# EAGLE design WeatherStation_pcb (EAGLE 7.5.0)
COMPANY: Unparallel; DRAWN: KTOWN; REV: B
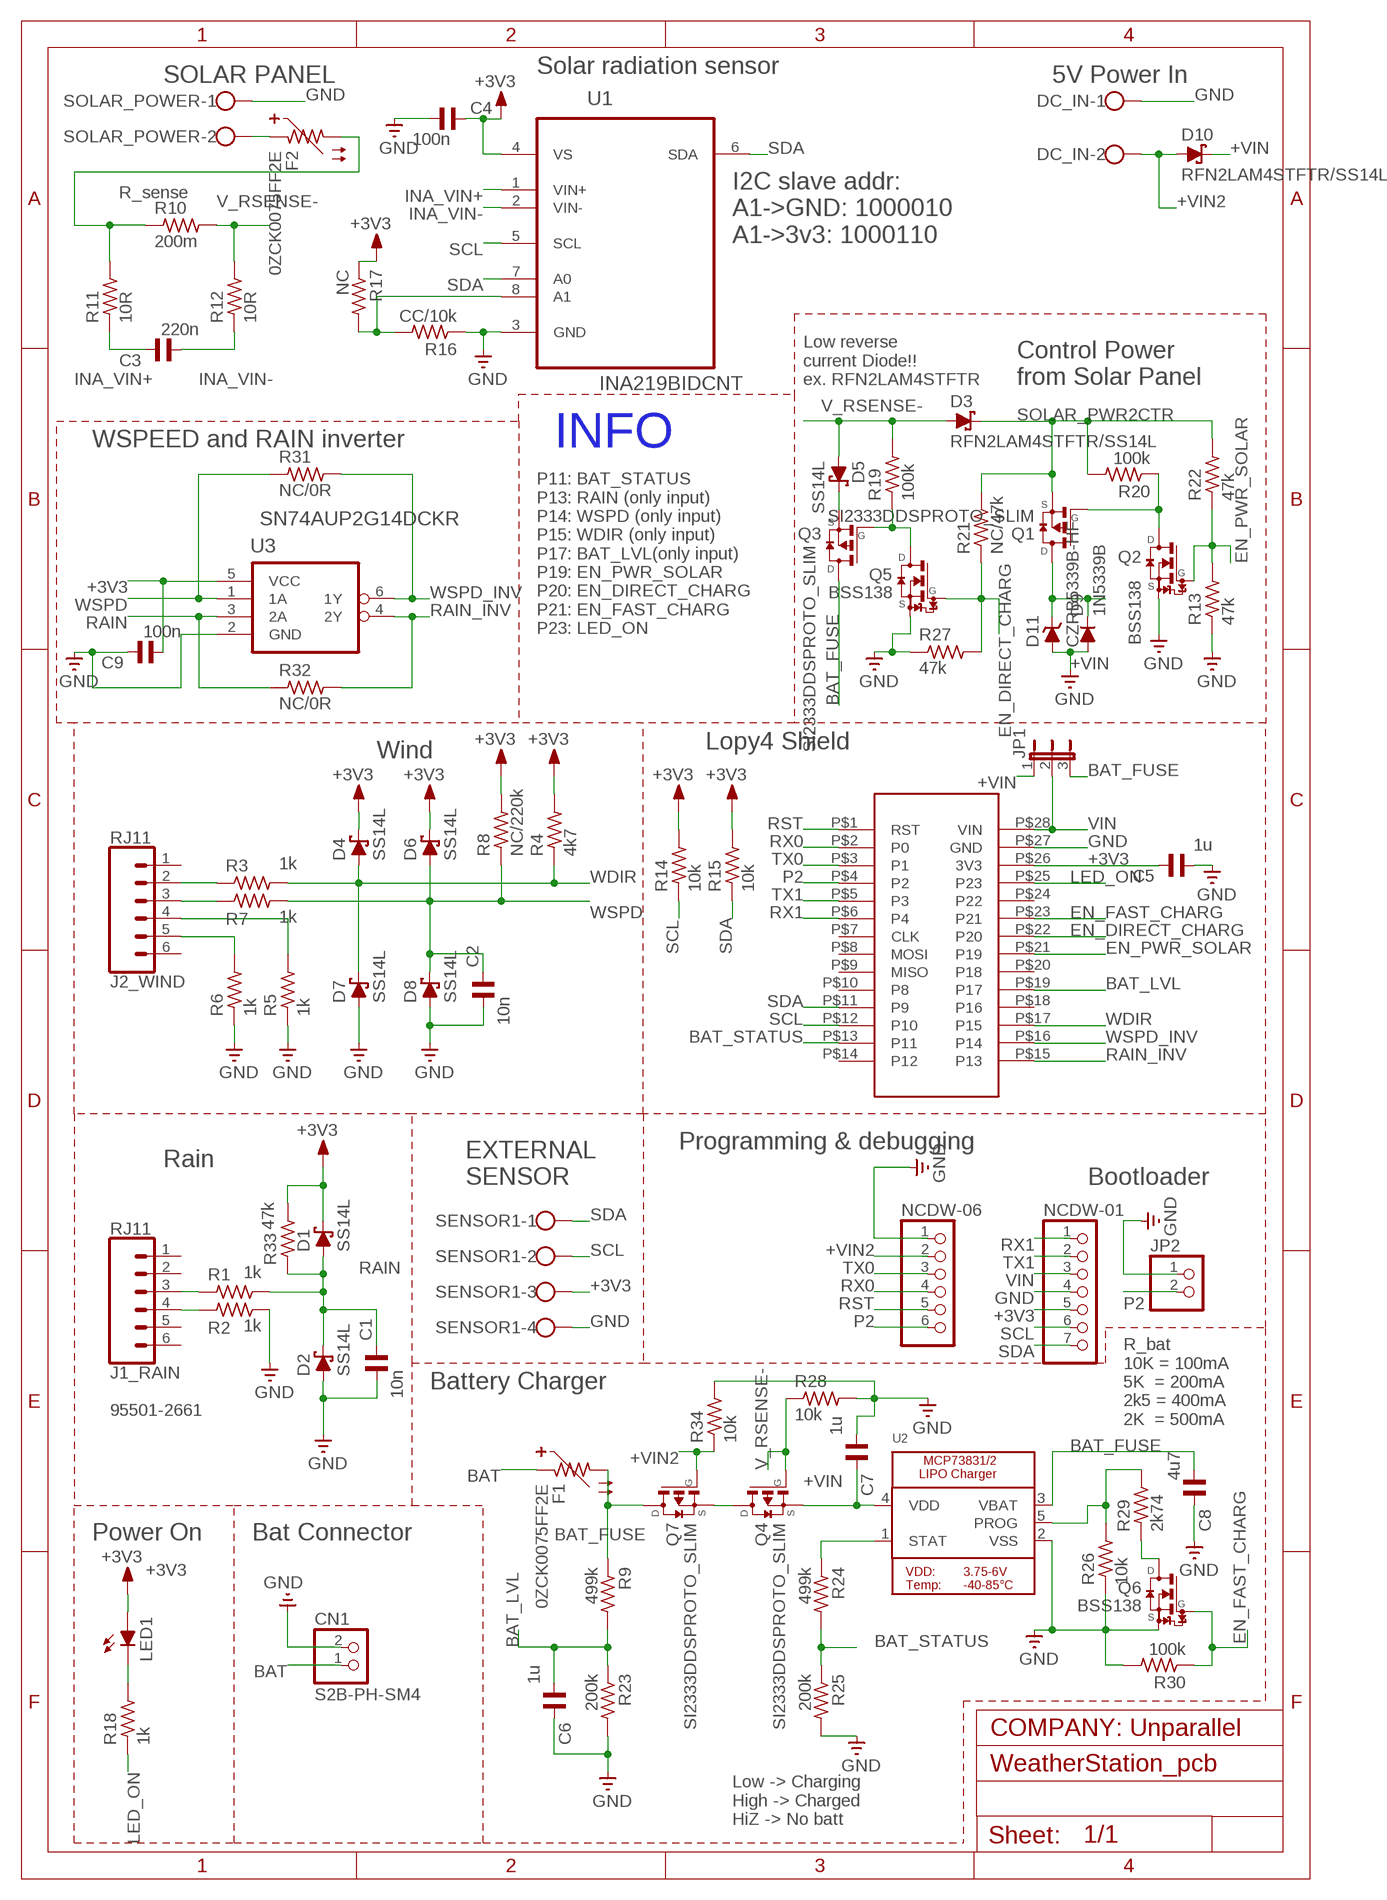
[diagram p0: schematic, sheet 1]

## Parts
C1  10n  C-EUC0603/C0805_PROTO_SLIM  [C0603/C0805_PROTO_SLIM]
C2  10n  C-EUC0603/C0805_PROTO_SLIM  [C0603/C0805_PROTO_SLIM]
C3  220n  C-EUC0603  [C0603]
C4  100n  C-EUC0603  [C0603]
C5  1u  C-EUC0603/C0805_PROTO_SLIM  [C0603/C0805_PROTO_SLIM]
C6  1u  C-EUC0603/C0805_PROTO_SLIM  [C0603/C0805_PROTO_SLIM]
C7  1u  C-EUC0603/C0805_PROTO_SLIM  [C0603/C0805_PROTO_SLIM]
C8  4u7  C-EUC0603/C0805_PROTO_SLIM  [C0603/C0805_PROTO_SLIM]
C9  100n  C-EUC0603  [C0603]
CN1  S2B-PH-SM4  JST_2PIN-SMT-RA  [JST-PH-2-SMT-RA]
D1  SS14L  SCHOTTKY-DIODESUB_SMA_PROTO  [SUB_SMA_PROTO]
D2  SS14L  SCHOTTKY-DIODESUB_SMA_PROTO  [SUB_SMA_PROTO]
D3  RFN2LAM4STFTR/SS14L  SCHOTTKY-DIODESMA_SOD-128_PROTO  [SMA_SOD-128_PROTO]
D4  SS14L  SCHOTTKY-DIODESUB_SMA_PROTO  [SUB_SMA_PROTO]
D5  SS14L  SCHOTTKY-DIODESUB_SMA_PROTO  [SUB_SMA_PROTO]
D6  SS14L  SCHOTTKY-DIODESUB_SMA_PROTO  [SUB_SMA_PROTO]
D7  SS14L  SCHOTTKY-DIODESUB_SMA_PROTO  [SUB_SMA_PROTO]
D8  SS14L  SCHOTTKY-DIODESUB_SMA_PROTO  [SUB_SMA_PROTO]
D9  1N5339B  DIODE-DO15-12  [DO15-12]
D10  RFN2LAM4STFTR/SS14L  SCHOTTKY-DIODESMA_SOD-128_PROTO  [SMA_SOD-128_PROTO]
D11  CZRB5339B-HF  ZENER-DIODE-PROTO  [SMB_PROTO]
DC_IN  W237-102  [W237-102]
F1  0ZCK0075FF2E  PTC-0603_0805_PROTO_SLIM  [R0603/R0805_PROTO_SLIM]
F2  0ZCK0075FF2E  PTC-0805  [R0805]
J1_RAIN  RJ11  RJ11-6  [RJ11-6]
J2_WIND  RJ11  RJ11-6  [RJ11-6]
JP1  JP2E-0805  [R0805/2]
JP2  PINHD-1X2  [1X02]
LED1  LEDCHIP-LED0805  [CHIP-LED0805]
NCDW-01  PINHD-1X7  [1X07]
NCDW-06  PINHD-1X6  [1X06]
Q1  SI2333DDSPROTO_SLIM  [SOT23_PROTO_SLIM]
Q2  BSS138  NX7002AKPROTO_SLIM  [SOT23_PROTO_SLIM]
Q3  SI2333DDSPROTO_SLIM  [SOT23_PROTO_SLIM]
Q4  SI2333DDSPROTO_SLIM  [SOT23_PROTO_SLIM]
Q5  BSS138  NX7002AKPROTO_SLIM  [SOT23_PROTO_SLIM]
Q6  BSS138  NX7002AKPROTO_SLIM  [SOT23_PROTO_SLIM]
Q7  SI2333DDSPROTO_SLIM  [SOT23_PROTO_SLIM]
R1  1k  R-EU_R0603  [R0603]
R2  1k  R-EU_R0603  [R0603]
R3  1k  R-EU_R0603  [R0603]
R4  4k7  R-EU_R0603/R0805_PROTO_SLIM  [R0603/R0805_PROTO_SLIM]
R5  1k  R-EU_R0603  [R0603]
R6  1k  R-EU_R0603  [R0603]
R7  1k  R-EU_R0603  [R0603]
R8  NC/220k  R-EU_R0603/R0805_PROTO_SLIM  [R0603/R0805_PROTO_SLIM]
R9  499k  R-EU_R0603/R0805_PROTO_SLIM  [R0603/R0805_PROTO_SLIM]
R10  200m  R-EU_R0603/R0805_PROTO_SLIM  [R0603/R0805_PROTO_SLIM]
R11  10R  R-EU_R0603  [R0603]
R12  10R  R-EU_R0603  [R0603]
R13  47k  R-EU_R0603  [R0603]
R14  10k  R-EU_R0603  [R0603]
R15  10k  R-EU_R0603  [R0603]
R16  CC/10k  R-EU_R0603  [R0603]
R17  NC  R-EU_R0603  [R0603]
R18  1k  R-EU_R0603  [R0603]
R19  100k  R-EU_R0603  [R0603]
R20  100k  R-EU_R0603  [R0603]
R21  NC/47k  R-EU_R0603  [R0603]
R22  47k  R-EU_R0603  [R0603]
R23  200k  R-EU_R0603/R0805_PROTO_SLIM  [R0603/R0805_PROTO_SLIM]
R24  499k  R-EU_R0603/R0805_PROTO_SLIM  [R0603/R0805_PROTO_SLIM]
R25  200k  R-EU_R0603/R0805_PROTO_SLIM  [R0603/R0805_PROTO_SLIM]
R26  10k  R-EU_R0603/R0805_PROTO_SLIM  [R0603/R0805_PROTO_SLIM]
R27  47k  R-EU_R0603  [R0603]
R28  10k  R-EU_R0603  [R0603]
R29  2k74  R-EU_R0603/R0805_PROTO_SLIM  [R0603/R0805_PROTO_SLIM]
R30  100k  R-EU_R0603/R0805_PROTO_SLIM  [R0603/R0805_PROTO_SLIM]
R31  NC/0R  R-EU_R0603/R0805_PROTO_SLIM  [R0603/R0805_PROTO_SLIM]
R32  NC/0R  R-EU_R0603/R0805_PROTO_SLIM  [R0603/R0805_PROTO_SLIM]
R33  47k  R-EU_R0603  [R0603]
R34  10k  R-EU_R0603  [R0603]
SENSOR1  W237-4  [W237-4]
SOLAR_POWER  W237-102  [W237-102]
U1  INA219BIDCNT  [SOT65P280X145-8N]
U2  MCP73831/2  [SOT23-5]
U3  SN74AUP2G14DCKR  SN74AUP2G14-DCKR  [SOT65P210X110-6N_EDIT]
U$2  LOPY4_SHIELD  [LOPY4_SHIELD]

## Nets
+3V3: C4.1 C5.1 C9.2 D1.C D4.C D6.C LED1.A NCDW-01.5 R4.2 R8.2 R14.2 R15.2 R17.1 R33.2 SENSOR1.3 U1.4(VS) U3.5(VCC) U$2.P$26(3V3)
+VIN: C7.1 D9.C D10.C D11.C JP1.1 Q1.3(D) Q4.2(S) U2.4(VDD)
+VIN2: D10.A DC_IN.2 NCDW-06.2 Q7.1(G) R34.1
BAT: CN1.1 F1.1
BAT_FUSE: C8.2 F1.2 JP1.3 Q3.3(D) Q7.3(D) R9.1 U2.3(VBAT)
BAT_LVL: C6.2 R9.2 R23.1 U$2.P$19(P17)
BAT_STATUS: R24.2 R25.1 U$2.P$13(P11)
EN_DIRECT_CHARG: Q5.1(G) R21.1 R27.2 U$2.P$22(P20)
EN_FAST_CHARG: Q6.1(G) R30.1 U$2.P$23(P21)
EN_PWR_SOLAR: Q2.1(G) R13.2 R22.1 U$2.P$21(P19)
GND: C1.2 C2.2 C4.2 C5.2 C6.1 C7.2 C8.1 C9.1 CN1.2 D2.A D7.A D8.A D9.A D11.A DC_IN.1 JP2.1 NCDW-01.4 NCDW-06.1 Q2.2(S) Q5.2(S) Q6.2(S) R2.2 R5.1 R6.1 R13.1 R16.1 R23.2 R25.2 R26.1 R27.1 R28.2 R30.2 R34.2 SENSOR1.4 SOLAR_POWER.1 U1.3(GND) U2.2(VSS) U3.2(GND) U$2.P$27(GND)
INA_VIN+: C3.1 R11.1 U1.1(VIN+)
INA_VIN-: C3.2 R12.1 U1.2(VIN-)
LED_ON: R18.1 U$2.P$25(P23)
N$1: D5.C Q3.2(S)
N$2: F2.1 SOLAR_POWER.2
N$3: J1_RAIN.4 R2.1
N$4: J1_RAIN.3 R1.1
N$5: J2_WIND.2 R3.1
N$6: J2_WIND.3 R7.1
N$7: J2_WIND.4 R5.2
N$8: J2_WIND.5 R6.2
N$10: R26.2 R29.2 U2.5(PROG)
N$11: R16.2 R17.2 U1.8(A1)
N$12: LED1.C R18.2
N$13: Q6.3(D) R29.1
N$15: Q3.1(G) Q5.3(D) R19.1
N$18: Q1.1(G) Q2.3(D) R20.1
N$19: R24.1 U2.1(STAT)
N$21: Q4.3(D) Q7.2(S)
P2: JP2.2 NCDW-06.6 U$2.P$4(P2)
RAIN: C1.1 D1.A D2.C R1.2 R32.1 R33.1 U3.3(2A)
RAIN_INV: R32.2 U3.4(2Y) U$2.P$15(P13)
RST: NCDW-06.5 U$2.P$1(RST)
RX0: NCDW-06.4 U$2.P$2(P0)
RX1: NCDW-01.1 U$2.P$6(P4)
SCL: NCDW-01.6 R14.1 SENSOR1.2 U1.5(SCL) U$2.P$12(P10)
SDA: NCDW-01.7 R15.1 SENSOR1.1 U1.6(SDA) U1.7(A0) U$2.P$11(P9)
SOLAR_PWR2CTR: D3.C Q1.2(S) R20.2 R21.2 R22.2
TX0: NCDW-06.3 U$2.P$3(P1)
TX1: NCDW-01.2 U$2.P$5(P3)
V_RSENSE-: D3.A D5.A Q4.1(G) R10.2 R12.2 R19.2 R28.1
VBUS_SOLAR: F2.2 R10.1 R11.2
VIN: JP1.2 NCDW-01.3 U$2.P$28(VIN)
WDIR: D4.A D7.C R3.2 R4.1 U$2.P$17(P15)
WSPD: C2.1 D6.A D8.C R7.2 R8.1 R31.1 U3.1(1A)
WSPD_INV: R31.2 U3.6(1Y) U$2.P$16(P14)
Unconnected: J1_RAIN.1 J1_RAIN.2 J1_RAIN.5 J1_RAIN.6 J2_WIND.1 J2_WIND.6 U$2.P$7(CLK) U$2.P$8(MOSI) U$2.P$9(MISO) U$2.P$10(P8) U$2.P$14(P12) U$2.P$18(P16) U$2.P$20(P18) U$2.P$24(P22)

## Notes on the sheet
- Solar radiation sensor
- SOLAR PANEL | 5V Power In
- R_sense
- I2C slave addr:
  A1->GND: 1000010
  A1->3v3: 1000110
- Low reverse
  current Diode!!
  ex. RFN2LAM4STFTR
- Control Power
  from Solar Panel
- WSPEED and RAIN inverter | INFO
- P11: BAT_STATUS
  P13: RAIN (only input)
  P14: WSPD (only input)
  P15: WDIR (only input)
  P17: BAT_LVL(only input)
  P19: EN_PWR_SOLAR
  P20: EN_DIRECT_CHARG
  P21: EN_FAST_CHARG
  P23: LED_ON
- Lopy4 Shield
- Wind
- Programming & debugging
- Rain
- EXTERNAL
  SENSOR
- Bootloader
- Battery Charger
- 95501-2661
- R_bat
  10K = 100mA
  5K  = 200mA
  2k5 = 400mA
  2K  = 500mA
- Power On | Bat Connector
- Low -> Charging
  High -> Charged
  HiZ -> No batt

## Library data of the parts
C1-C9 = rcl_imp:C-EU: CAPACITOR, European symbol
CN1 = adafruit_edit:JST_2PIN: JST 2-Pin Connectors of various flavors SMT-RA (S2B-PH-SM4) 4UConnector #17311 SMT (B2B-PH-SM4) THM-RA (S2B-PH) THM (B2B-PH)
D1-D8 D10 = diode:SCHOTTKY-DIODE: Schottky Diode
D9 = diode:DIODE-: DIODE
D11 = diode:ZENER-DIODE: Z-Diode
DC_IN SOLAR_POWER = con-wago-500:W237-102: WAGO SCREW CLAMP
F1 F2 = ptc-ntc:PTC: PTC THERMISTOR
J1_RAIN J2_WIND = SparkFun-Connectors:RJ11-6: RJ11 Jack - 6 pin Commonly found on CAT3 devices and some Microchip programmers. Here is the connector we sell at SparkFun: RJ11 6-Pin Connector <https://www.sparkfun.com/products/132> (PRT-00132) Datasheet <http://www.sparkfun.com/datasheets/Prototyping/Connectors/RJ11-Datasheet.pdf> It is used on this SparkFun product: SparkFun Weather Shield <https://www.sparkfun.com/products/12081> (DEV-12081) Weather Meters <https://www.sparkfun.com/products/8942> (SEN-08942); PROD_ID: CONN-08590; SF_ID: PRT-00132
JP1 = jumper:JP2E: JUMPER
JP2 = pinhead:PINHD-1X2: PIN HEADER
LED1 = led:LED: LED Various Types
NCDW-01 = pinhead:PINHD-1X7: PIN HEADER
NCDW-06 = pinhead:PINHD-1X6: PIN HEADER
Q1 Q3 Q4 Q7 = transistor-fet:SI2333DDS: P-Channel MOSFET
Q2 Q5 Q6 = transistor-fet:NX7002AK: N-Channel MOSFET
R1-R34 = rcl_imp:R-EU_: RESISTOR, European symbol
SENSOR1 = con-wago-500:W237-4: WAGO SCREW CLAMP
U1 = Texas Instruments_By_element14_Batch_1_new:INA219BIDCNT: CURRENT/POWER MONITOR with I2C? Interface; MPN: INA219BIDCNT; OC_FARNELL: 1855125; OC_NEWARK: 12T2860; PACKAGE: SOT-23-8; SUPPLIER: TEXAS INSTRUMENTS
U2 = microbuilder:MCP73831/2: MCP73831/2 LIPO Charger VDD: 3.75 - 6V Temp -40 - 85°C Programmable Charge Rate: 15-500mA NOTE: STAT is a tri-state logic output on the MCP73831 and an open-drain output on the MCP73832. SOT23-5 with 4.2V output and tri-state logic on STAT = MCP73831T-2ACI/OT
U3 = PatternAgents-TI:SN74AUP2G14: DUAL INVERTER GATE
U$2 = pycom_lib_edit:LOPY4_SHIELD

## Net classes
0 default: width 0.25 mm, drill 0.3 mm
2 VDD_3.3V: width 0.35 mm, drill 0.3 mm, clearance 0.2 mm

## Board
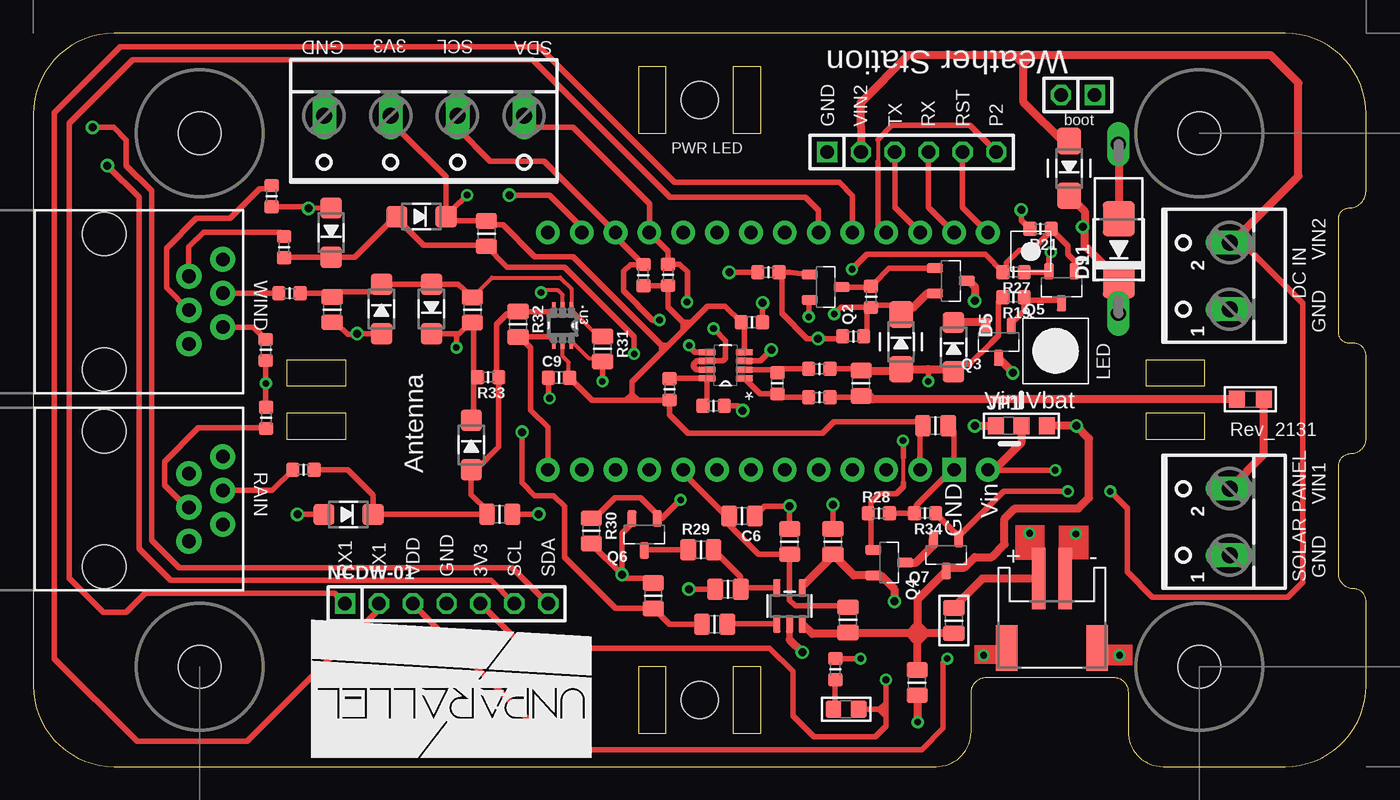
[diagram p1: board, top side]
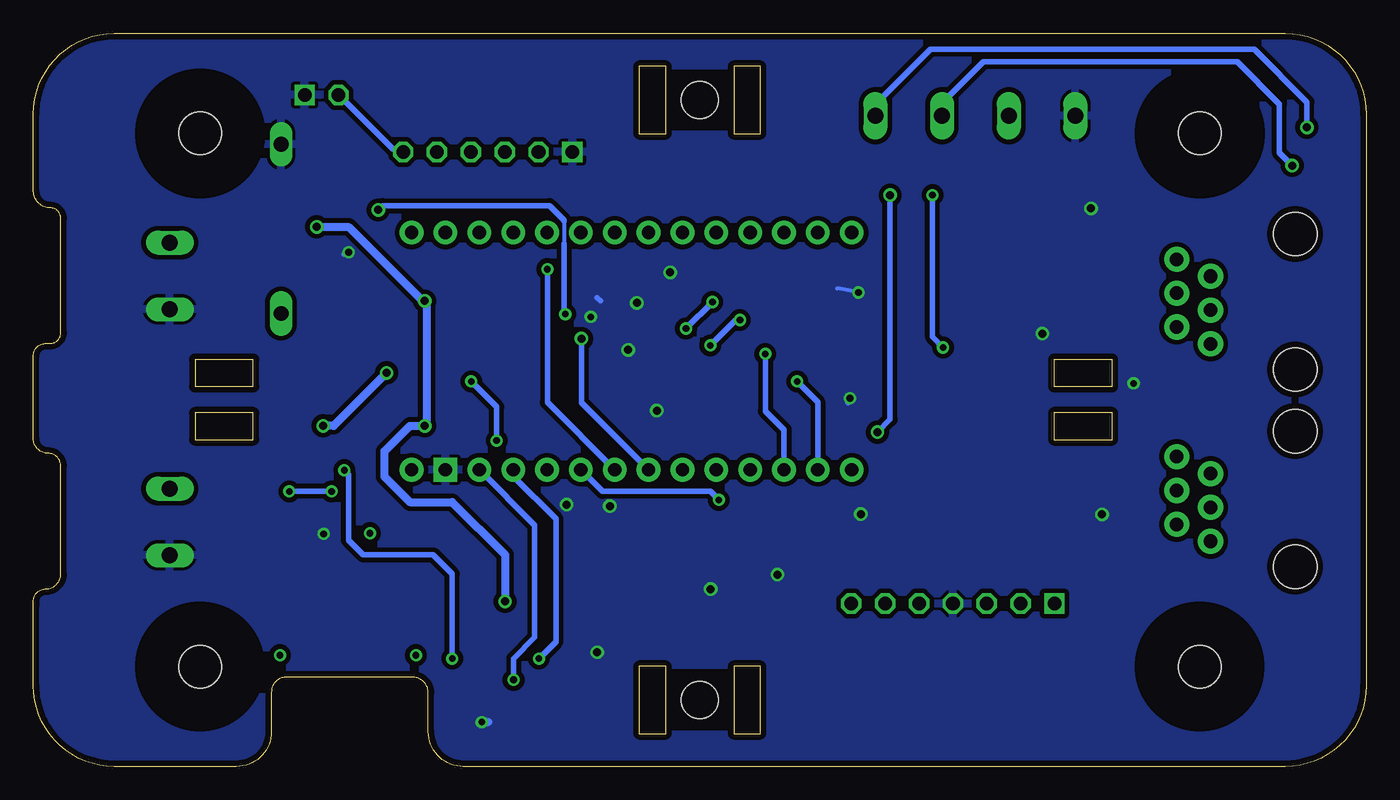
[diagram p2: board, bottom side, seen from below]

Size 100.01 x 55 mm. Coordinates in mm from the lower left corner, seen from the top.
Outline: 6.08,0 67.75,0 arc90 70.38,2.62 70.38,5.51 arc-90 71.52,6.7 81.07,6.7 arc-90 82.15,5.59 82.15,2.62 arc90 84.78,0 93.93,0 arc90 100,6.08 100.01,12.06 100.01,12.38 arc90 99.06,13.34 arc-90 97.95,14.45 97.95,22.54 arc-90 98.9,23.5 arc90 100.01,24.61 100.01,30.8 arc90 99.06,31.75 98.74,31.75 arc-90 97.95,32.54 97.95,41.12 arc-90 98.74,41.91 arc90 100,43.17 100,48.94 arc90 93.93,55 6.08,55 arc90 0,48.92 0,6.08 arc90 6.08,0
Outline: 19.05,26.52 23.43,26.52 23.43,24.52 19.05,24.52 19.05,26.52
Outline: 19.05,30.52 23.43,30.52 23.43,28.52 19.05,28.52 19.05,30.52
Outline: 83.5,26.52 87.88,26.52 87.88,24.52 83.5,24.52 83.5,26.52
Outline: 83.5,30.52 87.88,30.52 87.88,28.52 83.5,28.52 83.5,30.52
Outline: 52.55,47.48 52.55,52.52 54.55,52.52 54.55,47.48 52.55,47.48
Outline: 45.45,47.48 45.45,52.52 47.45,52.52 47.45,47.48 45.45,47.48
Outline: 52.55,2.48 52.55,7.53 54.55,7.53 54.55,2.48 52.55,2.48
Outline: 45.45,2.48 45.45,7.53 47.45,7.53 47.45,2.48 45.45,2.48
Copper layers (1*16): Top 0.035mm / dielectric 1.5mm / Bottom 0.035mm
Design rules "Weather_rules": minimum track width 0.3mm, minimum drill 0.299mm, track to track 14mil, track to pad 14mil, pad to pad 14mil, via to via 12mil, smd to smd 6mil, copper to edge 18mil, drill to drill 12mil, minimum pad ring 10mil, minimum via ring 8mil, stop-mask expansion 2mil, vias tented up to drill 25mil, thermal gap 10mil
Holes 3.2 mm at 12.5,7.5 87.5,7.5 12.5,47.5 87.5,47.5
bRestrict: area 7.8,2.8 to 17.2,12.2; area 7.8,42.8 to 17.1,52.1; area 82.8,42.8 to 92.2,52.2; area 82.8,2.8 to 92.2,12.2

### Footprints (pad centres in the part's own frame; a part is rotated, then mirrored left to right if it is on the bottom)
C0603/C0805_PROTO_SLIM = smd 1.2 x 1.6: 1 -0.95,0; 2 0.95,0
C0603 = smd 1 x 1.1: 1 -0.794,0; 2 0.794,0
JST-PH-2-SMT-RA = smd 1 x 4.6: 1 1,-3.7; 2 -1,-3.7 | smd 1.6 x 3.4: NC1 -3.4,1.5; NC2 3.4,1.5
SUB_SMA_PROTO = smd 1.6 x 1.6: A 1.85,0; C -1.85,0
SMA_SOD-128_PROTO = smd 2 x 1.8: A 2.05,0; C -2.05,0
DO15-12 = drill 1.118 long: A 6.35,0; C -6.35,0
SMB_PROTO = smd 2.6 x 2.4: A 2.322,0; C -2.322,0
W237-102 = drill 1.194 long: 1 -2.5,-1.27; 2 2.5,-1.27
R0603/R0805_PROTO_SLIM = smd 1.2 x 1.6: 1 -0.95,0; 2 0.95,0
R0805 = smd 1.2 x 1.3: 1 -1.016,0; 2 1.016,0
RJ11-6 = drill 1.016 pad 1.88: 1 -3.175,8.89; 2 -1.905,6.35; 3 -0.635,8.89; 4 0.635,6.35; 5 1.905,8.89; 6 3.175,6.35 | hole 3.251: -5.08,0; 5.08,0
R0805/2 = smd 1.2 x 1.3: 1 -1.905,0; 2 0,0; 3 1.905,0
1X02 = drill 1.016 square: 1 -1.27,0 | drill 1.016 octagon: 2 1.27,0
CHIP-LED0805 = smd 1.3 x 1.2: A 0,-0.953; C 0,0.953
1X07 = drill 1.016 square: 1 -7.62,0 | drill 1.016 octagon: 2 -5.08,0; 3 -2.54,0; 4 0,0; 5 2.54,0; 6 5.08,0; 7 7.62,0
1X06 = drill 1.016 square: 1 -6.35,0 | drill 1.016 octagon: 2 -3.81,0; 3 -1.27,0; 4 1.27,0; 5 3.81,0; 6 6.35,0
SOT23_PROTO_SLIM = smd 0.7 x 1.2: 1 -0.95,-1.2; 2 0.95,-1.2; 3 0,1.2
R0603 = smd 1 x 1.1: 1 -0.794,0; 2 0.794,0
W237-4 = drill 1.194 long: 1 -7.5,-1.27; 2 -2.5,-1.27; 3 2.5,-1.27; 4 7.5,-1.27
MOUNTHOLE_110MIL = hole 2.794: 0,0
SOT65P280X145-8N = smd 1.3 x 0.44: 1 -1.4,0.975; 2 -1.4,0.325; 3 -1.4,-0.325; 4 -1.4,-0.975; 5 1.4,-0.975; 6 1.4,-0.325; 7 1.4,0.325; 8 1.4,0.975
SOT23-5 = smd 0.55 x 1.3: 1 -0.95,-1.35; 2 0,-1.35; 3 0.95,-1.35; 4 0.95,1.35; 5 -0.95,1.35
SOT65P210X110-6N_EDIT = smd 1.168 x 0.356: 1 -1.168,0.66; 2 -1.168,0; 3 -1.168,-0.66; 4 1.168,-0.66; 5 1.168,0; 6 1.168,0.66
LOPY4_SHIELD = drill 1 pad 1.778: P$1 0,0; P$2 2.54,0; P$3 5.08,0; P$4 7.62,0; P$5 10.16,0; P$6 12.7,0; P$7 15.24,0; P$8 17.78,0; P$9 20.32,0; P$10 22.86,0; P$11 25.4,0; P$12 27.94,0; P$13 30.48,0; P$14 33.02,0; P$15 33.02,17.78; P$16 30.48,17.78; P$17 27.94,17.78; P$18 25.4,17.78; P$19 22.86,17.78; P$20 20.32,17.78; P$21 17.78,17.78; P$22 15.24,17.78; P$23 12.7,17.78; P$24 10.16,17.78; P$25 7.62,17.78; P$26 5.08,17.78; P$28 0,17.78 | drill 1 pad 1.778 square: P$27 2.54,17.78

### Placement (x,y rotation side)
C1  35,18.93 0 top
C2  22.43,34.27 270 top
C3  55.82,28.75 90 top
C4  53.92,33.33 0 top
C5  67.7,25.57 0 top
C6  53.17,18.79 180 top
C7  60,16.88 90 top
C8  66.32,6.3 90 top
C9  39.44,29.17 0 top
CN1  76.42,10.4 180 top
D1  32.86,24.12 270 top
D2  23.65,18.91 180 top
D3  65.11,31.86 270 top
D4  29.12,41.25 180 top
D5  69.05,31.46 270 top
D6  29.88,34.33 90 top
D7  22.35,40.05 90 top
D8  26.12,34.33 270 top
D9  81.42,40.33 90 top
D10  77.71,44.87 90 top
D11  81.44,38.76 90 top
DC_IN  88.5,36.8 90 top
F1  69.08,10.95 270 top
F2  91.33,27.55 180 top
J1_RAIN  5.33,20.07 270 top
J2_WIND  5.33,34.88 270 top
JP1  74.14,25.56 0 top
JP2  78.38,50.38 180 top
LED1  60.99,4.3 90 top
NCDW-01  31.01,12.22 0 top
NCDW-06  65.91,46.1 0 top
Q1  68.85,36.44 270 top
Q2  59.45,35.96 270 top
Q3  72.43,31.86 180 top
Q4  64.22,15.3 270 top
Q5  77.15,35.96 180 top
Q6  45.86,17.41 180 top
Q7  68.5,15.88 180 top
R1  20.27,22.27 0 top
R2  17.47,26.16 90 top
R3  18.81,38.96 270 top
R4  34,39.98 90 top
R5  17.87,42.79 90 top
R6  17.45,31.25 90 top
R7  19.23,35.5 0 top
R8  32.95,34.25 270 top
R9  61.12,11 90 top
R10  62.11,28.75 90 top
R11  58.98,27.7 0 top
R12  58.98,29.82 0 top
R13  55.16,37.08 0 top
R14  45.77,36.86 270 top
R15  47.63,36.89 270 top
R16  51.05,27.05 180 top
R17  47.75,28.3 90 top
R18  60.18,7.31 270 top
R19  73.55,35.21 180 top
R20  62.87,35.23 270 top
R21  75.57,40.34 180 top
R22  61.52,32.27 0 top
R23  56.75,16.88 90 top
R24  51.12,10.68 180 top
R25  46.52,12.82 90 top
R26  52.12,13.3 0 top
R27  73.55,37.08 180 top
R28  63.45,19 0 top
R29  50.09,16.27 0 top
R30  41.87,17.67 270 top
R31  42.72,31.32 270 top
R32  36.37,33.17 270 top
R33  34.13,29.21 180 top
R34  66.91,19 180 top
SENSOR1  29.32,47.55 180 top
SOLAR_POWER  88.5,18.35 90 top
STAND2  [MOUNTHOLE_110MIL]  50,5 90 top
STAND3  [MOUNTHOLE_110MIL]  50,50 90 top
U1  51.95,30.1 180 top
U2  56.75,12.05 0 top
U3  39.71,33.09 270 top
U$1  [UNPARALLEL_LOGO_NEW_0_INVERT_BIG]  41.91,11.01 180 top
U$2  71.62,40.05 180 top

### Tracks (layer width: path | path; a pad name or v marks a point on that pad's centre or on a via)
+3V3  (via drill 0.5)
  Top 0.305: C9.2 40.16,29.24 40.16,30.32 39.71,30.77 U3.5
  Top 0.406: U1.4 53.35,33.11 C4.1 51.92,34.54 50.59,34.54 48.75,32.69 | 31.75,32.48 31.95,32.48 32.67,33.2 R8.2 33.19,33.19 32.89,33.02 33.02,33.02 33.02,28.73 | 31.75,32.48 D6.C | 32.89,26 D1.C 33.02,26.13 33.02,28.73 | SENSOR1.3 26.8,48.42 27.43,47.77 30.98,44.23 30.98,41.75 | 30.98,41.75 D4.C 31.27,40.96 31.3,40.93 R4.2 34.34,40.64 35.24,40.64 37.62,38.26 40.48,38.26 47.15,31.59 | 48.75,32.69 47,30.95 | 47,30.95 44.93,28.87 44.93,27.94 | C9.2 41.94,27.46 45.4,27.46 | 45.4,27.46 47.71,27.46 R17.1 47.75,26.38 49.12,25 59.21,25 60.09,25.88 66.36,25.88 66.66,25.57 C5.1 66.55,25.36 U$2.P$26 | 44.45,27.46 44.93,27.94 | 44.93,27.94 45.4,27.46 | R14.2 47.29,36.07 R15.2 47.63,34.44 48.74,33.34 | 49.37,33.34 48.74,33.34 | 48.74,33.34 48.74,32.7 48.75,32.69 | R33.2 33.5,29.21 | 33.02,29.53 33.5,29.21 | 33.5,29.21 33.02,28.73 | 47.31,31.43 47.15,31.59 | 47.15,31.59 47.62,31.59 | 47.15,31.59 47.15,31.11 47,30.95 | v31.75,31.43 31.75,32.48 | v32.54,42.86 31.43,41.75 30.98,41.75 | 63.98,5.86 v63.98,6.51 63.98,4.76 | NCDW-01.5 36.88,8.89 55.24,8.89 56.99,7.14 56.99,3.81 58.58,2.22 63.18,2.22 63.98,3.02 63.98,4.76 | LED1.A 62.23,4.3 62.23,4.29 63.5,4.29 | 63.98,3.81 63.5,4.29 | 63.5,4.29 63.98,4.76
  Bottom 0.406: 26.82,47.35 SENSOR1.3 | v31.75,31.43 32.54,32.23 v32.54,42.86 | U$2.P$26 62.39,18.11 62.39,9.68 63.98,8.1 v63.98,6.51 63.82,6.67
+VIN  (via drill 0.6)
  Top 0.5: 57.78,13.61 57.7,13.53 U2.4
  Top 0.61: Q1.3 70.17,36.43 70.22,36.43 70.64,36.01 v70.64,34.92 | v70.64,25.56 JP1.1 | v64.61,12.38 64.61,13.34 63.6,14.35 Q4.2 61.58,14.35 C7.1 60,15.82 57.78,13.61 | D9.C 81.44,34 D11.C 81.44,36.51 78.9,39.05 78.9,40.32 | D10.C 78.9,41.64 78.9,40.32 | 78.9,40.32 v78.74,40.48
  Bottom 0.61: v64.61,12.38 64.61,15.88 68.58,19.84 71.75,19.84 73.66,21.75 73.66,23.65 71.75,25.56 v70.64,25.56 70.48,25.72 70.48,34.77 v70.64,34.92 70.8,34.92 76.36,40.48 v78.74,40.48
+VIN2  (via drill 0.5)
  Top 0.406: Q7.1 69.45,17.38 69.61,17.54 | v77.63,20.64 72.83,20.64 69.45,17.26 Q7.1 | DC_IN.2 89.86,39.21 90.81,39.21 95.25,34.77 95.25,13.82 94.13,12.7 83.98,12.7 82.07,14.61 82.07,19.37 v80.8,20.64 | R34.1 67.94,18.76 67.94,18.73 69.45,17.23 Q7.1
  Top 0.61: NCDW-06.2 62.1,47.94 62.09,49.8 65.63,53.34 73.66,53.34 | DC_IN.2 89.94,39.3 94.93,44.29 94.93,51.28 92.87,53.34 73.66,53.34 | D10.A 77.54,46.61 74.3,49.85 74.3,52.7 | 74.93,53.34 74.3,52.7 | 74.3,52.7 73.66,53.34
  Bottom 0.406: v77.63,20.64 v80.8,20.64
BAT
  Top 0.61: CN1.1 71.21,14.1 69.22,12.11 69.22,12.06 F1.1
BAT_FUSE  (via drill 0.6)
  Top 0.406: 57.76,10.64 U2.3
  Top 0.5: R9.1 61.04,10 60.99,9.95
  Top 0.61: 60.99,9.95 58.45,9.95 57.76,10.64 | F1.2 69.03,10.05 68.95,10.05 68.9,10 65.72,10 | C8.2 66.32,7.42 66.36,7.46 66.36,9.37 | 65.72,10 61.17,10 R9.1 | 66.36,9.37 66.99,10 66.36,10.64 | 66.36,9.37 65.72,10 | Q3.3 73.5,29.58 v73.5,29.53 | JP1.3 v78.26,25.56 79.22,24.61 79.22,20.16 78.42,19.37 73.66,19.37 72.87,18.57 72.87,16.67 71.91,15.72 70.64,15.72 69.85,14.92 68.75,14.92 Q7.3 66.36,12.53 66.36,10.64 | 66.36,10.64 65.72,10
  Bottom 0.61: v73.5,29.53 77.47,25.56 v78.26,25.56
BAT_LVL
  Top 0.406: R9.2 60.96,11.99 60.9,12.05 57.17,12.05 56.75,12.47 R23.1 54.4,15.93 52.23,18.1 C6.2 51.97,19.05 51.75,19.05 48.77,22.04 U$2.P$19
BAT_STATUS  (via drill 0.6)
  Top 0.406: R24.2 47.73,10.68 46.83,11.57 46.67,11.59 R25.1 43.69,11.87 39.85,15.72 39.85,19.53 39.05,20.32 37.62,20.32 36.67,21.27 v36.67,25.08 | v35.72,42.86 38.73,42.86 41.15,40.45 U$2.P$13
  Bottom 0.406: v36.67,25.08 35.72,26.04 v35.72,42.86
EN_DIRECT_CHARG  (via drill 0.5)
  Top 0.406: v61.44,37.31 62.55,38.42 71.42,38.42 R27.2 73.03,37.35 73.03,37.78 73.98,38.73 74.93,38.73 76.37,40.17 R21.1 | R21.1 76.83,39.87 | Q5.1 78.1,37.94 77.63,38.42 77.63,39.08 R21.1
  Bottom 0.406: U$2.P$22 61.44,27.32 v61.44,37.31
EN_FAST_CHARG  (via drill 0.5)
  Top 0.406: R30.1 42.13,18.89 42.39,18.89 43.66,20.16 45.56,20.16 46.83,18.89 46.83,18.63 Q6.1 47.18,18.61 v48.58,20
  Bottom 0.406: v48.58,20 49.21,20.64 57.31,20.64 58.92,22.25 U$2.P$23
EN_PWR_SOLAR  (via drill 0.6)
  Top 0.406: R22.1 60.41,32.1 v58.88,32.1 58.06,32.1 56.16,33.99 56.16,37.02 R13.2 56.75,37.07 Q2.1
  Bottom 0.406: U$2.P$21 58.88,27.31 v58.88,32.1
GND  (via drill 0.5, 0.6)
  Top 0.305: U3.2 39.71,35.38 39.37,35.72 38.26,35.72 v38.1,35.56
  Top 0.406: U1.3 54.55,30.43 v55.38,31.25 | C7.2 v60,19.65 | C4.2 v54.73,34.77 | R13.1 v52.22,37.08 | C1.2 v37.91,18.93 | D2.A v19.82,18.91 | R6.1 v17.45,28.74 17.45,27.09 R2.2 | D8.A v24.3,32.48 23.75,32.42 23.57,32.42 22.77,33.23 C2.2 | D7.A v20.65,41.88 20.52,42 R5.1 | R16.1 52.88,27.05 v53.23,26.7 | R25.2 46.04,14.13 44.44,14.13 v44.17,14.4 | R26.1 v49.19,13.3 | R23.2 v56.75,19.54 54.87,19.54 C6.1 | Q2.2 58.18,35.17 v58.18,33.74 v58.18,33.73 58.26,33.97 | Q6.2 44.91,18.24 44.17,17.5 v44.17,14.4 | R30.2 44.17,14.41 v44.17,14.4 | C9.1 38.65,27.71 v38.73,27.62 | C5.2 69.08,25.14 69.08,22.41 | R27.1 76.13,37.08 Q5.2 76.2,38.42 v76.36,38.58 | U$2.P$27 69.08,22.41 | R28.2 R34.2 66.2,19.05 66.27,19.12 66.27,19.6 69.08,22.41
  Top 0.5: U2.2 56.75,9.53
  Top 0.61: CN1.2 77.42,16.62 78.05,17.25 v78.22,17.45 | C8.1 66.32,5.12 66.36,5.08 v66.36,3.33 | 56.75,9.53 v57.7,8.58 | D9.A 81.44,46.67 D11.A
  Bottom 0.305: v38.1,35.56 39.69,35.88
  Bottom 0.406: 57.71,35.16 57.47,34.92 | v38.73,27.62 38.73,27.46 38.89,27.3 | v76.36,38.58 76.52,38.58 76.68,38.42
  Bottom 0.61: v66.36,3.33 65.88,3.33
  pour Bottom: 6.08,0 93.93,0 arc90 100,6.08 100,48.94 arc90 93.93,55 6.08,55 arc90 0,48.92 0,6.08 arc90
INA_VIN+
  Top 0.406: U1.1 54.52,27.96 C3.1 56.08,27.7 R11.1
INA_VIN-
  Top 0.406: R12.1 56.1,29.82 C3.2 55.66,29.77 U1.2
LED_ON  (via drill 0.5)
  Top 0.406: R18.1 61.6,8.1 v62.07,8.1
  Bottom 0.406: v62.07,8.1 60.8,9.37 60.8,18.57 64,21.78 U$2.P$25
N$1
  Top 0.61: Q3.2 71.22,33.31 D5.C
N$2
  Top 0.61: SOLAR_POWER.2 92.34,23.42 F2.1
N$3
  Top 0.406: R2.1 17.44,25.4 12.38,25.4 9.84,22.86 9.84,21.11 11.52,19.44 J1_RAIN.4
N$4
  Top 0.406: J1_RAIN.3 17.92,20.71 R1.1
N$5
  Top 0.406: R3.1 18.73,39.85 18.51,40.07 12.77,40.07 11.68,38.98 J2_WIND.2
N$6
  Top 0.406: R7.1 18.2,35.51 J2_WIND.3
N$7
  Top 0.406: J2_WIND.4 10,35.91 10,38.89 12.22,41.12 14.76,41.12 16.99,43.34 17.46,43.34 17.71,43.58 R5.2
N$8
  Top 0.406: R6.2 16.53,32.97 J2_WIND.5
N$10
  Top 0.406: U2.5 53.56,13.4 R26.2 53.08,14.23 R29.2
N$11
  Top 0.406: R17.2 47.78,29.12 U1.8 50.55,27.34 R16.2
N$12
  Top 0.406: LED1.C 60.17,4.43 60.17,4.6 60.17,6.5 R18.2
N$13
  Top 0.406: R29.1 45.92,16.27 Q6.3
N$15
  Top 0.406: Q5.3 76.92,34.99 74.56,34.99 R19.1 74.34,34.18 73.5,33.34 73.5,33.18 Q3.1
N$16  (via drill 0.5)
  other vias: 71.3,8.35
N$17  (via drill 0.5)
  other vias: 81.5,8.35
N$18
  Top 0.406: Q2.3 62.8,35.96 R20.1 63.04,36.2 63.02,36.2 64.22,37.39 67.87,37.39 67.79,37.31 Q1.1
N$19
  Top 0.406: U2.1 52.2,10.7 R24.1
N$20  (via drill 0.5)
  other vias: 74.75,17.5
N$21
  Top 0.61: Q4.3 66.25,15.3 67.47,16.52 67.47,16.99 Q7.2
P2
  Top 0.305: 63.37,47.03 63.37,45.36
  Top 0.406: NCDW-06.6 70.26,48.1 64.44,48.1 63.37,47.03 | 63.37,45.36 63.37,40.68 U$2.P$4
  Bottom 0.406: NCDW-06.6 72.59,46.1 72.79,46.3 73.03,46.3 JP2.2
RAIN
  Top 0.406: R1.2 23.57,22.27 25.45,20.4 25.45,20.38 25.5,20.32 D2.C C1.1 34.05,18.81 34.05,19.13 34.05,19.21 32.86,20.4 D1.A 33.13,22.38 33.34,22.38 34.92,23.97 R33.1 34.92,29.37 34.77,29.53 34.77,33.18 35.56,33.97 36.22,33.97 R32.1 38.92,34.12 U3.3
RAIN_INV
  Top 0.406: U3.4 38.75,32.22 R32.2 36.69,31.91 36.83,31.91 37.31,31.43 37.31,26.74 38.6,25.45 U$2.P$15
RST
  Top 0.406: 71.64,40.06 U$2.P$1 69.72,41.95 NCDW-06.5
RX0
  Top 0.406: 69.09,40.06 U$2.P$2 67.18,41.95 NCDW-06.4
RX1
  Top 0.406: U$2.P$6 58.92,41.72 57.94,42.7 47.78,42.7 37.47,53.02 7.46,53.02 2.7,48.26 2.7,14.13 5.24,11.59 6.99,11.59 8.41,13.02 22.6,13.02 NCDW-01.1
SCL  (via drill 0.5, 0.6)
  Top 0.406: U1.5 49.65,31.07 49.21,31.52 v49.21,31.59 | v46.99,33.5 46.48,33.5 44.27,35.7 44.27,37.14 44.79,37.66 R14.1 43.69,39.74 U$2.P$12 38.33,45.4 34.29,45.4 31.82,47.87 SENSOR1.2 | NCDW-01.6 34.34,13.97 10.32,13.97 7.94,16.35 7.94,42.7 v5.56,45.09
  Bottom 0.406: v49.21,31.59 47.31,33.5 v46.99,33.5 | v5.56,45.09 6.51,46.04 6.51,49.69 9.68,52.86 28.73,52.86 31.82,49.77 SENSOR1.2
SDA  (via drill 0.5, 0.6)
  Top 0.406: U1.7 49.76,29.77 49.53,30 49.53,30.16 49.79,30.43 U1.6 51.75,30.43 51.95,30.62 51.95,31.95 v51.04,32.86 | v49.05,34.85 49.08,34.95 49.08,37.1 48.5,37.68 R15.1 47.63,38.64 U$2.P$11 46.23,42.2 40.48,47.94 37.62,47.94 36.83,48.74 SENSOR1.1 | NCDW-01.7 35.93,14.92 10.95,14.92 8.89,16.99 8.89,43.18 6.99,45.09 6.99,46.99 6.03,47.94 v4.45,47.94
  Bottom 0.406: v49.05,34.85 v51.04,32.86 | SENSOR1.1 36.67,48.97 36.67,49.85 32.7,53.82 8.41,53.82 4.45,49.85 v4.45,47.94
SOLAR_PWR2CTR  (via drill 0.5, 0.6)
  Top 0.406: R20.2 62.85,34.44 62.55,34.45 62.55,32.5 R22.2 | R20.2 63.01,34.61 64.73,34.61 D3.C | R21.2 74.14,40.98 v74.14,41.75 | v60.1,33.94 60.59,34.44 R20.2
  Top 0.61: D3.C 65.58,34.22 66.04,34.45 67.08,35.49 Q1.2
  Bottom 0.305: 60.19,40.9 60.19,39.21
  Bottom 0.406: v74.14,41.75 73.82,42.07 61.28,42.07 60.19,40.98 60.19,40.9 | 60.19,39.21 60.19,34.03 v60.1,33.94
TX0
  Top 0.406: U$2.P$3 64.64,41.97 NCDW-06.3
TX1
  Top 0.406: U$2.P$5 61.47,42.83 60.48,43.81 48.1,43.81 37.94,53.98 6.51,53.98 1.59,49.05 1.59,8.1 7.78,1.91 16.03,1.91 25.93,11.8 NCDW-01.2
V_RSENSE-  (via drill 0.5)
  Top 0.305: 65.28,21.3 65.28,23.21
  Top 0.406: 61.91,29.77 61.98,29.7 R10.2 61.99,29.82 R12.2 | R19.2 72.43,34.88 72.43,32.33 71.86,31.76 71.85,31.76 70.26,30.16 69.69,30.16 69.14,29.61 D5.A | 65.28,21.3 65.28,20.98 64.77,20.48 63.5,20.48 62.87,19.84 62.87,19 R28.1 62.87,18.79 62.87,16.4 Q4.1 | 65.28,23.21 65.28,24.42 v65.25,24.45 | v67.15,28.89 67.15,29.81
  Top 0.61: R10.2 65.31,29.7 D3.A 67.15,29.81 68.85,29.81 D5.A
  Bottom 0.406: v65.25,24.45 65.25,26.99 v67.15,28.89
VBUS_SOLAR
  Top 0.406: R11.2 62.01,27.7 R10.1
  Top 0.61: 62.42,27.71 R10.1 62.74,27.8 62.99,27.55 F2.2
VIN  (via drill 0.5)
  Top 0.406: v68.58,8.1 68.26,7.78 68.26,2.86 66.67,1.27 39.42,1.27 NCDW-01.3 | U$2.P$28 71.62,22.36 72.39,22.23 75.72,22.23 v76.68,22.23
  Top 0.61: JP1.2 74.14,24.29 72.12,22.27 U$2.P$28
  Bottom 0.406: v68.58,8.1 68.58,14.45 70.01,15.88 75.25,15.88 76.36,16.99 76.36,21.91 v76.68,22.23
WDIR  (via drill 0.5)
  Top 0.406: R4.1 33.81,39.21 33.93,39.09 | 33.93,39.09 29.28,39.09 27.45,40.92 D4.A 27,41.1 24.1,38.2 D7.C 18.93,38.2 R3.2 | 33.93,39.09 35.56,37.47 39.85,37.47 45.09,32.23 v45.09,30.96
  Bottom 0.406: v45.09,30.96 45.09,26.67 43.69,25.27 U$2.P$17
WSPD
  Top 0.305: R31.1 42.36,32.27 U3.1 40.37,35.83 39.53,36.67 34.42,36.67 R8.1
  Top 0.406: R8.1 31.88,36.17 D6.A D8.C 26.02,36.17 25.59,35.6 22.77,35.6 C2.1 22.23,35.5 R7.2
WSPD_INV  (via drill 0.5)
  Top 0.305: U3.6 41.65,30.64 42.23,30.64 42.49,30.37 R31.2
  Top 0.406: R31.2 42.7,30.36 v42.7,28.89
  Bottom 0.406: v42.7,28.89 41.15,27.33 U$2.P$16
(copper drawn outside any net)
  shapes: Top area x4

### Text on the board
tPlace: GND | 3V3 | SCL | SDA | Weather Station | boot | GND | VIN2 | TX | RX | RST | P2 | PWR LED | VIN2 | DC IN | WIND | GND | LED | Vin | Vbat | Rev_2131 | SOLAR PANEL | RAIN | Antenna | GND | Vin | VIN1 | GND | RX1 | TX1 | VDD | GND | 3V3 | SCL | SDA